# Altium project LittleRC.PrjPCB
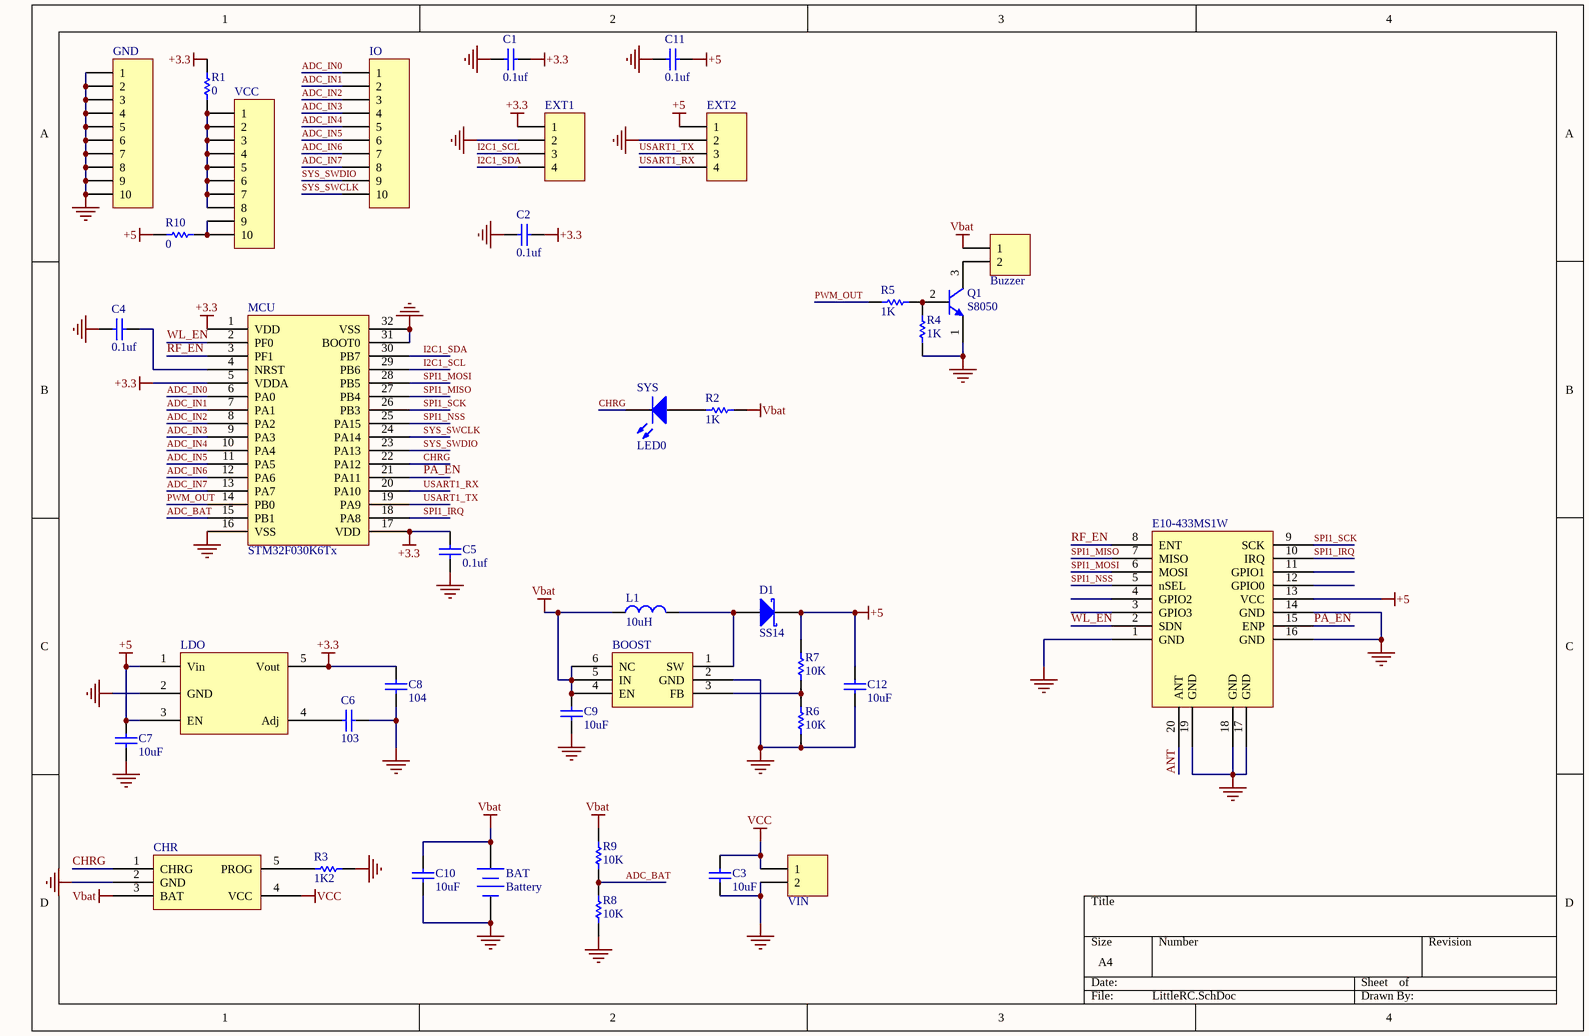
[diagram p0: LittleRC.SchDoc]
1 sheet, 39 parts. Net scope: global (net labels, ports and power ports of the same name join across sheets).
Board file: LittleRC.PcbDoc

## Sheet LittleRC.SchDoc
size A4

### Parts
BAT  Battery  [HDR2X1_B1]
BOOST  SX1308  (value not drawn)
Buzzer  Header 2  [HDR2X1_B1]  (value not drawn)
C1  value 0.1uf  [0603-1]  (hidden comment: Cap)
C2  value 0.1uf  [CAP-3528]  (hidden comment: Cap)
C3  value 10uF  [0603-1]  (hidden comment: Cap)
C4  value 0.1uf  [0603-1]  (hidden comment: Cap)
C5  value 0.1uf  [0603-1]  (hidden comment: Cap)
C6  value 103  [0603-1]  (hidden comment: Cap)
C7  value 10uF  [0603-1]  (hidden comment: Cap)
C8  value 104  [0603-1]  (hidden comment: Cap)
C9  value 10uF  [0603-1]  (hidden comment: Cap)
C10  value 10uF  [CAP-3528]  (hidden comment: Cap)
C11  value 0.1uf  [0603-1]  (hidden comment: Cap)
C12  value 10uF  [RB.1/.2-F]  (hidden comment: Cap)
CHR  LTC4054  [SOT23-5]  (value not drawn)
D1  Type: SS14  [DIODE-SMA]  (hidden comment: D-Schottky)
E10-433MS1W  SPI-E10433MS1W  [SPI-E10433MS1W]  (value not drawn)
EXT1  Header 4  [HDR1X4]  (value not drawn)
EXT2  Header 4  [HDR1X4]  (value not drawn)
GND  Header 10  [HDR1X10]  (value not drawn)
IO  Header 10  [HDR1X10]  (value not drawn)
L1  value 10uH  [0630]  (hidden comment: Inductor)
LDO  SPX3819  [SOT23-5]  (value not drawn)
MCU  STM32F030K6Tx  [LQFP-32]
Q1  S8050  [SOT-23]
R1  value 0  [jumper]  (hidden comment: Res1)
R2  value 1K  [0603-1]  (hidden comment: Res1)
R3  value 1K2  [0603-1]  (hidden comment: Res1)
R4  value 1K  [0603-1]  (hidden comment: Res1)
R5  value 1K  [0603-1]  (hidden comment: Res1)
R6  value 10K  [0603-1]  (hidden comment: Res1)
R7  value 10K  [0603-1]  (hidden comment: Res1)
R8  value 10K  [0603-1]  (hidden comment: Res1)
R9  value 10K  [0603-1]  (hidden comment: Res1)
R10  value 0  [jumper]  (hidden comment: Res1)
SYS  LED0  [0603-1]
VCC  Header 10  [HDR1X10]  (value not drawn)
VIN  Header 2  [HDR2X1_B1]  (value not drawn)

### Nets
+3.3: C1.1 C2.1 C5.2 C8.2 EXT1.1 LDO.5(Vout) MCU.1(VDD) MCU.5(VDDA) MCU.17(VDD) R1.2
+5: C7.2 C11.1 C12.2 D1.2(K) E10-433MS1W.13(VCC) EXT2.1 LDO.1(Vin) LDO.3(EN) R7.2 R10.2
GND: BAT.2(-) BOOST.2(GND) C1.2 C2.2 C3.1 C4.2 C5.1 C6.1 C7.1 C8.1 C9.1 C10.1 C11.2 C12.1 CHR.2(GND) E10-433MS1W.1(GND) E10-433MS1W.14(GND) E10-433MS1W.16(GND) E10-433MS1W.17(GND) E10-433MS1W.18(GND) E10-433MS1W.19(GND) EXT1.2 EXT2.2 GND.1 GND.2 GND.3 GND.4 GND.5 GND.6 GND.7 GND.8 GND.9 GND.10 LDO.2(GND) MCU.16(VSS) MCU.31(BOOT0) MCU.32(VSS) Q1.1(E) R3.2 R4.2 R6.1 R8.2 VIN.2
Vbat: BAT.1(+) BOOST.4(EN) BOOST.5(IN) BOOST.6(NC) Buzzer.1 C9.2 C10.2 CHR.3(BAT) L1.1 R2.1 R9.1
VCC: C3.2 CHR.4(VCC) VIN.1
ADC_BAT: MCU.15(PB1) R8.1 R9.2
ADC_IN0: IO.1 MCU.6(PA0)
ADC_IN1: IO.2 MCU.7(PA1)
ADC_IN2: IO.3 MCU.8(PA2)
ADC_IN3: IO.4 MCU.9(PA3)
ADC_IN4: IO.5 MCU.10(PA4)
ADC_IN5: IO.6 MCU.11(PA5)
ADC_IN6: IO.7 MCU.12(PA6)
ADC_IN7: IO.8 MCU.13(PA7)
ANT: E10-433MS1W.20(ANT)
CHRG: CHR.1(CHRG) MCU.22(PA12) SYS.2(K)
I2C1_SCL: EXT1.3 MCU.29(PB6)
I2C1_SDA: EXT1.4 MCU.30(PB7)
PA_EN: E10-433MS1W.15(ENP) MCU.21(PA11)
PWM_OUT: MCU.14(PB0) R5.2
RF_EN: E10-433MS1W.8(ENT) MCU.3(PF1)
SPI1_IRQ: E10-433MS1W.10(IRQ) MCU.18(PA8)
SPI1_MISO: E10-433MS1W.7(MISO) MCU.27(PB4)
SPI1_MOSI: E10-433MS1W.6(MOSI) MCU.28(PB5)
SPI1_NSS: E10-433MS1W.5(nSEL) MCU.25(PA15)
SPI1_SCK: E10-433MS1W.9(SCK) MCU.26(PB3)
SYS_SWCLK: IO.10 MCU.24(PA14)
SYS_SWDIO: IO.9 MCU.23(PA13)
USART1_RX: EXT2.4 MCU.20(PA10)
USART1_TX: EXT2.3 MCU.19(PA9)
WL_EN: E10-433MS1W.2(SDN) MCU.2(PF0)
NetBOOST_1: BOOST.1(SW) D1.1(A) L1.2
NetBOOST_3: BOOST.3(FB) R6.2 R7.1
NetBuzzer_2: Buzzer.2 Q1.3(C)
NetC4_1: C4.1 MCU.4(NRST)
NetC6_2: C6.2 LDO.4(Adj)
NetCHR_5: CHR.5(PROG) R3.1
NetQ1_2: Q1.2(B) R4.1 R5.1
NetR1_1: R1.1 VCC.1 VCC.2 VCC.3 VCC.4 VCC.5 VCC.6 VCC.7 VCC.8
NetR2_2: R2.2 SYS.1(A)
NetR10_1: R10.1 VCC.9 VCC.10

Not connected (* = marked no-connect by the designer): E10-433MS1W 3(GPIO3) 4(GPIO2) 11(GPIO1) 12(GPIO0)

### Library data of the parts
BAT = Battery: Multicell Battery; pin to pad: 1>2 2>1; Published: 24-Mar-1999; LatestRevisionDate: 17-Jul-2002; LatestRevisionNote: Re-released for DXP Platform.; PackageReference: BAT-2; Publisher: Altium Limited; PackageDescription: Battery; 2 Leads
Buzzer VIN = Header 2: 接插件; pin to pad: 1>2 2>1; LatestRevisionDate: 17-Jul-2002; LatestRevisionNote: Re-released for DXP Platform.; Publisher: Altium Limited
C1-C12 = Cap: Capacitor; Published: 8-Jun-2000; LatestRevisionDate: 17-Jul-2002; LatestRevisionNote: Re-released for DXP Platform.; PackageReference: RAD-0.3; Publisher: Altium Limited; PackageDescription: Radial Cap, Thru-Hole; 2 Leads; 0.3 in Pin Spacing
D1 = D-Schottky: 肖特基二极管; Published: 8-Jun-2000; LatestRevisionDate: 17-Jul-2002; LatestRevisionNote: Re-released for DXP Platform.; PackageReference: SMB; Publisher: Altium Limited; Code_JEDEC: DO-214-AA
EXT1 EXT2 = Header 4: Header, 4-Pin; LatestRevisionDate: 17-Jul-2002; LatestRevisionNote: Re-released for DXP Platform.; Publisher: Altium Limited
GND IO VCC = Header 10: Header, 10-Pin; LatestRevisionDate: 17-Jul-2002; LatestRevisionNote: Re-released for DXP Platform.; Publisher: Altium Limited
L1 = Inductor: 电感; Code_IEC: 1005; Published: 8-Jun-2000; LatestRevisionDate: 17-Jul-2002; LatestRevisionNote: Re-released for DXP Platform.; PackageReference: 0402-A; Publisher: Altium Limited; Code_JEITA: 0402
Q1 = S8050: NPN三极管; pin to pad: 1>2 2>3 3>1; Published: 8-Jun-2000; LatestRevisionDate: 15-Jan-2003; LatestRevisionNote: PCB Footprint 'BCY-W3/D4.7' replaced; DatasheetDocument: 1997; PackageDocument: Sep-1998; PackageReference: TO-92A; Publisher: Altium Limited; Code_JEDEC: TO-92A; ComponentLink1Description: Manufacturer Link; ComponentLink1URL: http://www.fairchildsemi.com/; ComponentLink2Description: Datasheet; ComponentLink2URL: http://www.fairchildsemi.com/ds/2N%2F2N3904.pdf
R1-R10 = Res1: Resistor; Published: 8-Jun-2000; LatestRevisionDate: 17-Jul-2002; LatestRevisionNote: Re-released for DXP Platform.; PackageReference: AXIAL-0.3; Publisher: Altium Limited; PackageDescription: Axial Device, Thru-Hole; 2 Leads; 0.3 in Pin Spacing
SYS = LED0: Typical INFRARED GaAs LED; Published: 8-Jun-2000; LatestRevisionDate: 08-Jul-2005; LatestRevisionNote: Mech Layer 1 removed.; PackageReference: LED-0; Publisher: Altium Limited; PackageDescription: LED; 2 Leads